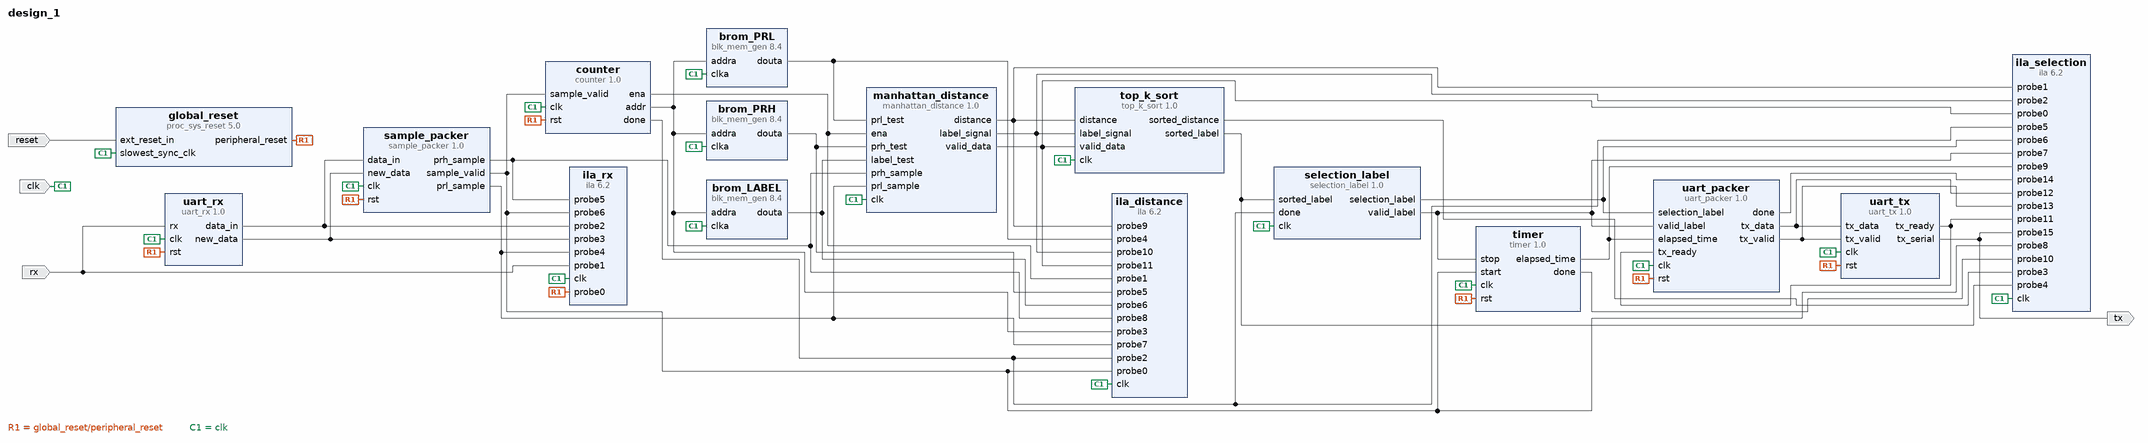
[diagram p0: block diagram of the top level]
# Vivado block design design_1, xc7a100tcsg324-1, Vivado 2025.1
create_bd_design design_1

create_bd_port -dir I -type clk clk
create_bd_port -dir I rx
create_bd_port -dir O tx
create_bd_port -dir I -type rst reset
set_property -dict {CONFIG.POLARITY ACTIVE_LOW} [get_bd_ports reset]

create_bd_cell -type ip -vlnv xilinx.com:user:uart_rx:1.0 uart_rx
create_bd_cell -type ip -vlnv xilinx.com:user:sample_packer:1.0 sample_packer
create_bd_cell -type ip -vlnv xilinx.com:user:counter:1.0 counter
set_property -dict {CONFIG.ADDR_WIDTH 10 CONFIG.MAX_ADDR 742} [get_bd_cells counter]
create_bd_cell -type ip -vlnv xilinx.com:ip:blk_mem_gen:8.4 brom_PRL
set_property -dict [list \
  CONFIG.Coe_File {../../../../../../../trabajo de titulo_termino/python/prl.coe} \
  CONFIG.Enable_A Always_Enabled \
  CONFIG.Load_Init_File true \
  CONFIG.Memory_Type Single_Port_ROM \
  CONFIG.Write_Depth_A 745 \
  CONFIG.Write_Width_A 16 \
  CONFIG.use_bram_block Stand_Alone \
] [get_bd_cells brom_PRL]
create_bd_cell -type ip -vlnv xilinx.com:ip:blk_mem_gen:8.4 brom_PRH
set_property -dict [list \
  CONFIG.Coe_File {../../../../../../../trabajo de titulo_termino/python/prh.coe} \
  CONFIG.Enable_A Always_Enabled \
  CONFIG.Load_Init_File true \
  CONFIG.Memory_Type Single_Port_ROM \
  CONFIG.Write_Depth_A 745 \
  CONFIG.Write_Width_A 16 \
  CONFIG.use_bram_block Stand_Alone \
] [get_bd_cells brom_PRH]
create_bd_cell -type ip -vlnv xilinx.com:ip:blk_mem_gen:8.4 brom_LABEL
set_property -dict [list \
  CONFIG.Coe_File {../../../../../../../trabajo de titulo_termino/python/labels.coe} \
  CONFIG.Enable_A Always_Enabled \
  CONFIG.Load_Init_File true \
  CONFIG.Memory_Type Single_Port_ROM \
  CONFIG.Write_Depth_A 745 \
  CONFIG.Write_Width_A 1 \
  CONFIG.use_bram_block Stand_Alone \
] [get_bd_cells brom_LABEL]
create_bd_cell -type ip -vlnv xilinx.com:user:top_k_sort:1.0 top_k_sort
create_bd_cell -type ip -vlnv xilinx.com:user:selection_label:1.0 selection_label
create_bd_cell -type ip -vlnv xilinx.com:user:uart_packer:1.0 uart_packer
create_bd_cell -type ip -vlnv xilinx.com:user:uart_tx:1.0 uart_tx
set_property -dict {CONFIG.BAUD 460800} [get_bd_cells uart_tx]
create_bd_cell -type ip -vlnv xilinx.com:user:timer:1.0 timer
create_bd_cell -type ip -vlnv xilinx.com:ip:proc_sys_reset:5.0 global_reset
set_property -dict {CONFIG.RESET_BOARD_INTERFACE reset CONFIG.USE_BOARD_FLOW true} [get_bd_cells global_reset]
create_bd_cell -type ip -vlnv xilinx.com:user:manhattan_distance:1.0 manhattan_distance
create_bd_cell -type ip -vlnv xilinx.com:ip:ila:6.2 ila_rx
set_property -dict [list \
  CONFIG.C_DATA_DEPTH 32768 \
  CONFIG.C_MONITOR_TYPE Native \
  CONFIG.C_NUM_OF_PROBES 7 \
  CONFIG.C_PROBE2_WIDTH 16 \
  CONFIG.C_PROBE4_WIDTH 16 \
  CONFIG.C_PROBE5_WIDTH 16 \
] [get_bd_cells ila_rx]
create_bd_cell -type ip -vlnv xilinx.com:ip:ila:6.2 ila_distance
set_property -dict [list \
  CONFIG.C_MONITOR_TYPE Native \
  CONFIG.C_NUM_OF_PROBES 12 \
  CONFIG.C_PROBE3_WIDTH 10 \
  CONFIG.C_PROBE4_WIDTH 16 \
  CONFIG.C_PROBE5_WIDTH 16 \
  CONFIG.C_PROBE6_WIDTH 1 \
  CONFIG.C_PROBE7_WIDTH 16 \
  CONFIG.C_PROBE8_WIDTH 16 \
  CONFIG.C_PROBE9_WIDTH 17 \
] [get_bd_cells ila_distance]
create_bd_cell -type ip -vlnv xilinx.com:ip:ila:6.2 ila_selection
set_property -dict {CONFIG.C_DATA_DEPTH 1024 CONFIG.C_MONITOR_TYPE Native CONFIG.C_NUM_OF_PROBES 16} [get_bd_cells ila_selection]

# ---- connections ----

connect_bd_net [get_bd_pins global_reset/peripheral_reset] \
  [get_bd_pins uart_packer/rst] [get_bd_pins uart_tx/rst] [get_bd_pins sample_packer/rst] [get_bd_pins uart_rx/rst] \
  [get_bd_pins counter/rst] [get_bd_pins timer/rst] [get_bd_pins ila_rx/probe0]
connect_bd_net [get_bd_pins brom_LABEL/douta] [get_bd_pins ila_distance/probe6] [get_bd_pins manhattan_distance/label_test]
connect_bd_net [get_bd_pins brom_PRH/douta] [get_bd_pins manhattan_distance/prh_test] [get_bd_pins ila_distance/probe5]
connect_bd_net [get_bd_pins brom_PRL/douta] [get_bd_pins manhattan_distance/prl_test] [get_bd_pins ila_distance/probe4]
connect_bd_net -net clk_0_1 [get_bd_ports clk] \
  [get_bd_pins uart_rx/clk] [get_bd_pins sample_packer/clk] [get_bd_pins counter/clk] [get_bd_pins brom_PRL/clka] \
  [get_bd_pins brom_PRH/clka] [get_bd_pins brom_LABEL/clka] [get_bd_pins top_k_sort/clk] [get_bd_pins selection_label/clk] \
  [get_bd_pins uart_packer/clk] [get_bd_pins uart_tx/clk] [get_bd_pins timer/clk] [get_bd_pins global_reset/slowest_sync_clk] \
  [get_bd_pins ila_rx/clk] [get_bd_pins ila_distance/clk] [get_bd_pins ila_selection/clk] \
  [get_bd_pins manhattan_distance/clk]
connect_bd_net [get_bd_pins counter/addr] \
  [get_bd_pins brom_PRL/addra] [get_bd_pins brom_PRH/addra] [get_bd_pins brom_LABEL/addra] [get_bd_pins ila_distance/probe3]
connect_bd_net [get_bd_pins counter/done] [get_bd_pins selection_label/done] [get_bd_pins ila_distance/probe2] [get_bd_pins ila_selection/probe5]
connect_bd_net [get_bd_pins counter/ena] [get_bd_pins ila_distance/probe1] [get_bd_pins manhattan_distance/ena]
connect_bd_net [get_bd_pins manhattan_distance/distance] \
  [get_bd_pins top_k_sort/distance] [get_bd_pins ila_distance/probe9] [get_bd_pins ila_selection/probe1]
connect_bd_net [get_bd_pins manhattan_distance/label_signal] \
  [get_bd_pins top_k_sort/label_signal] [get_bd_pins ila_distance/probe10] [get_bd_pins ila_selection/probe2]
connect_bd_net [get_bd_pins manhattan_distance/valid_data] \
  [get_bd_pins top_k_sort/valid_data] [get_bd_pins ila_distance/probe11] [get_bd_pins ila_selection/probe0]
connect_bd_net [get_bd_ports reset] [get_bd_pins global_reset/ext_reset_in]
connect_bd_net -net rx_0_1 [get_bd_ports rx] [get_bd_pins uart_rx/rx] [get_bd_pins ila_rx/probe1]
connect_bd_net [get_bd_pins sample_packer/prh_sample] \
  [get_bd_pins ila_rx/probe5] [get_bd_pins ila_distance/probe8] [get_bd_pins manhattan_distance/prh_sample]
connect_bd_net [get_bd_pins sample_packer/prl_sample] \
  [get_bd_pins ila_rx/probe4] [get_bd_pins ila_distance/probe7] [get_bd_pins manhattan_distance/prl_sample]
connect_bd_net [get_bd_pins sample_packer/sample_valid] \
  [get_bd_pins counter/sample_valid] [get_bd_pins timer/start] [get_bd_pins ila_rx/probe6] [get_bd_pins ila_distance/probe0] \
  [get_bd_pins ila_selection/probe8]
connect_bd_net [get_bd_pins selection_label/selection_label] [get_bd_pins uart_packer/selection_label] [get_bd_pins ila_selection/probe6]
connect_bd_net [get_bd_pins selection_label/valid_label] \
  [get_bd_pins uart_packer/valid_label] [get_bd_pins timer/stop] [get_bd_pins ila_selection/probe7]
connect_bd_net [get_bd_pins timer/done] [get_bd_pins ila_selection/probe10]
connect_bd_net [get_bd_pins timer/elapsed_time] [get_bd_pins uart_packer/elapsed_time] [get_bd_pins ila_selection/probe9]
connect_bd_net [get_bd_pins top_k_sort/sorted_distance] [get_bd_pins ila_selection/probe3]
connect_bd_net [get_bd_pins top_k_sort/sorted_label] [get_bd_pins selection_label/sorted_label] [get_bd_pins ila_selection/probe4]
connect_bd_net [get_bd_pins uart_packer/done] [get_bd_pins ila_selection/probe14]
connect_bd_net [get_bd_pins uart_packer/tx_data] [get_bd_pins uart_tx/tx_data] [get_bd_pins ila_selection/probe12]
connect_bd_net [get_bd_pins uart_packer/tx_valid] [get_bd_pins uart_tx/tx_valid] [get_bd_pins ila_selection/probe13]
connect_bd_net [get_bd_pins uart_rx/data_in] [get_bd_pins sample_packer/data_in] [get_bd_pins ila_rx/probe2]
connect_bd_net [get_bd_pins uart_rx/new_data] [get_bd_pins sample_packer/new_data] [get_bd_pins ila_rx/probe3]
connect_bd_net -net uart_tx_0_tx_ready [get_bd_pins uart_tx/tx_ready] [get_bd_pins uart_packer/tx_ready] [get_bd_pins ila_selection/probe11]
connect_bd_net -net uart_tx_0_tx_serial [get_bd_pins uart_tx/tx_serial] [get_bd_ports tx] [get_bd_pins ila_selection/probe15]

validate_bd_design
save_bd_design
